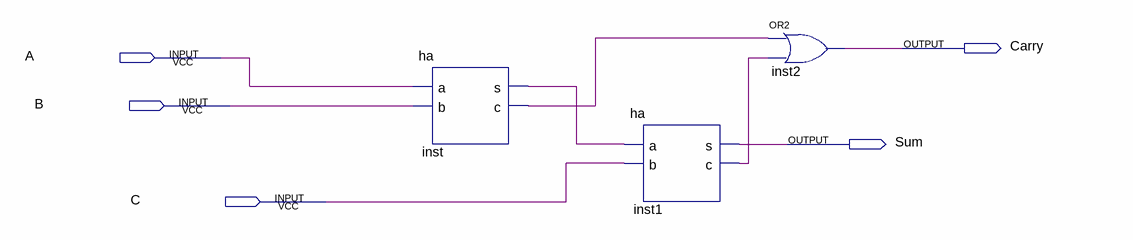
[diagram p0: schematic sheet]
// Quartus schematic fa.bdf as structural Verilog: 3 symbols, 5 pins
module fa (
  input  A,
  input  B,
  input  C,
  output Carry,
  output Sum
);

  wire inst1_c, inst_c, inst_s;

  ha inst (.a(A), .b(B), .s(inst_s), .c(inst_c));
  ha inst1 (.a(inst_s), .b(C), .s(Sum), .c(inst1_c));
  or inst2 (Carry, inst_c, inst1_c);
endmodule
